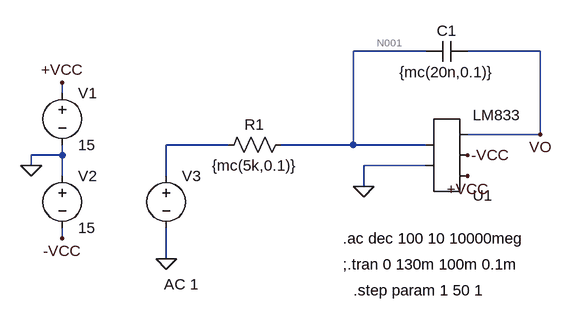
[diagram p0: schematic Integrador con montecarlo.asc]
* Integrador con montecarlo.asc
V1 +VCC 0 15
V2 0 -VCC 15
* U1: LM833 (symbol AutoGenerated\LM833 not available, pins judged from their places): pin1=0 pin2=N001 pin3=+VCC pin4=-VCC pin5=VO
V3 N002 0 AC 1
C1 VO N001 {mc(20n,0.1)}
R1 N001 N002 {mc(5k,0.1)}
.ac dec 100 10 10000meg
;.tran 0 130m 100m 0.1m
.step param 1 50 1
.backanno
.end

* Results of the author's LTspice run, read from the files saved beside the schematic
* Operating Point (first step), zero values left out:
*   1 = 1 
*   V(+vcc) = 15 V
*   V(-vcc) = -15 V
*   V(n001) = 1.244 mV
*   V(vo) = -14.38 V
*   I(R1) = 245.7 nA
*   I(V3) = 245.7 nA
*   I(V2) = -25.89 mA
*   I(V1) = -25.89 mA
*   Ix(u1:2) = -254.3 nA
*   Ix(u1:1) = -245.7 nA
*   Ix(u1:4) = 25.89 mA
*   Ix(u1:5) = -25.89 mA
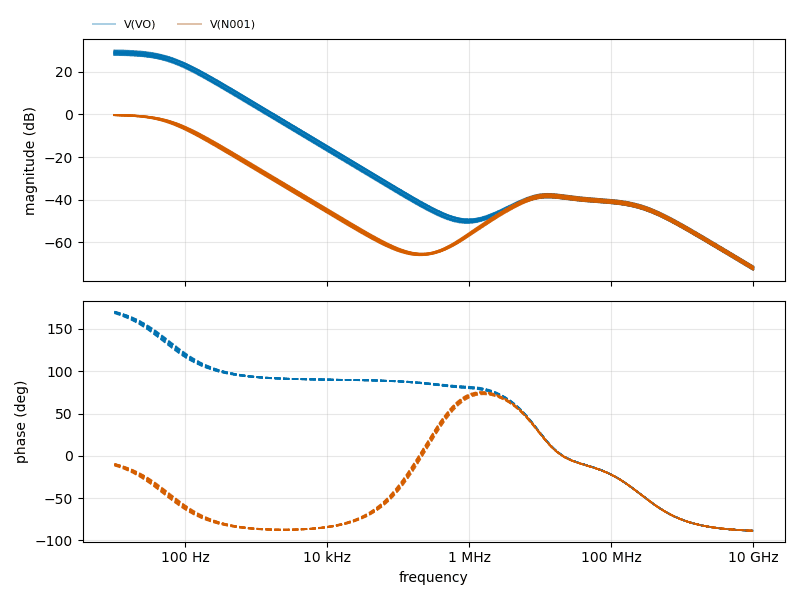
[diagram p1: AC Analysis of Integrador con montecarlo.asc, plotted from the saved traces]
* AC Analysis, 11 runs:
*   V(VO) [1=1]: 28.71 dB at 10 Hz, -72.34 dB at 10 GHz, peak 28.71 dB at 10 Hz, 3 dB below the peak at 62.63 Hz
*   V(VO) [1=5.9]: 28.15 dB at 10 Hz, -72.75 dB at 10 GHz, peak 28.15 dB at 10 Hz, 3 dB below the peak at 60.99 Hz
*   V(VO) [1=10.8]: 28.87 dB at 10 Hz, -72.19 dB at 10 GHz, peak 28.87 dB at 10 Hz, 3 dB below the peak at 55.57 Hz
*   V(VO) [1=15.7]: 27.96 dB at 10 Hz, -72.89 dB at 10 GHz, peak 27.96 dB at 10 Hz, 3 dB below the peak at 59.37 Hz
*   V(VO) [1=20.6]: 28.25 dB at 10 Hz, -72.64 dB at 10 GHz, peak 28.25 dB at 10 Hz, 3 dB below the peak at 54.02 Hz
*   V(VO) [1=25.5]: 28.04 dB at 10 Hz, -72.83 dB at 10 GHz, peak 28.04 dB at 10 Hz, 3 dB below the peak at 61.37 Hz
*   V(VO) [1=30.4]: 28.78 dB at 10 Hz, -72.25 dB at 10 GHz, peak 28.78 dB at 10 Hz, 3 dB below the peak at 54.42 Hz
*   V(VO) [1=35.3]: 30.05 dB at 10 Hz, -71.34 dB at 10 GHz, peak 30.05 dB at 10 Hz, 3 dB below the peak at 56.83 Hz
*   V(N001) [1=1]: -0.27 dB at 10 Hz, -72.33 dB at 10 GHz, peak -0.27 dB at 10 Hz, 3 dB below the peak at 62.63 Hz
*   V(N001) [1=5.9]: -0.28 dB at 10 Hz, -72.75 dB at 10 GHz, peak -0.28 dB at 10 Hz, 3 dB below the peak at 60.99 Hz
*   V(N001) [1=10.8]: -0.30 dB at 10 Hz, -72.19 dB at 10 GHz, peak -0.30 dB at 10 Hz, 3 dB below the peak at 55.57 Hz
*   V(N001) [1=15.7]: -0.29 dB at 10 Hz, -72.89 dB at 10 GHz, peak -0.29 dB at 10 Hz, 3 dB below the peak at 59.37 Hz
*   V(N001) [1=20.6]: -0.31 dB at 10 Hz, -72.64 dB at 10 GHz, peak -0.31 dB at 10 Hz, 3 dB below the peak at 54.02 Hz
*   V(N001) [1=25.5]: -0.28 dB at 10 Hz, -72.83 dB at 10 GHz, peak -0.28 dB at 10 Hz, 3 dB below the peak at 61.37 Hz
*   V(N001) [1=30.4]: -0.30 dB at 10 Hz, -72.25 dB at 10 GHz, peak -0.30 dB at 10 Hz, 3 dB below the peak at 54.42 Hz
*   V(N001) [1=35.3]: -0.28 dB at 10 Hz, -71.34 dB at 10 GHz, peak -0.28 dB at 10 Hz, 3 dB below the peak at 56.83 Hz